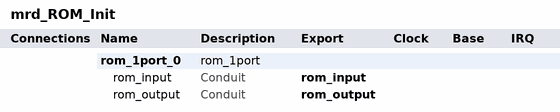
[diagram p0: system contents]
# Platform Designer (Qsys) system mrd_ROM_Init, Arria 10 10AX115U3F45E2SGE3
# Parameters at their usual value, and those the tool derives, are not listed.
package require qsys
create_system mrd_ROM_Init
set_project_property DEVICE_FAMILY {Arria 10}
set_project_property DEVICE 10AX115U3F45E2SGE3

add_instance rom_1port_0 rom_1port 15.1
set_instance_property rom_1port_0 AUTO_EXPORT true
set_instance_parameter_value rom_1port_0 GUI_ADDRESSSTALL_A false
set_instance_parameter_value rom_1port_0 GUI_AclrAddr false
set_instance_parameter_value rom_1port_0 GUI_AclrOutput false
set_instance_parameter_value rom_1port_0 GUI_BlankMemory 1
set_instance_parameter_value rom_1port_0 GUI_CLOCK_ENABLE_INPUT_A false
set_instance_parameter_value rom_1port_0 GUI_CLOCK_ENABLE_OUTPUT_A false
set_instance_parameter_value rom_1port_0 GUI_FILE_REFERENCE 0
set_instance_parameter_value rom_1port_0 GUI_INIT_FILE_LAYOUT PORT_A
set_instance_parameter_value rom_1port_0 GUI_INIT_TO_SIM_X false
set_instance_parameter_value rom_1port_0 GUI_JTAG_ENABLED false
set_instance_parameter_value rom_1port_0 GUI_JTAG_ID NONE
set_instance_parameter_value rom_1port_0 GUI_MAXIMUM_DEPTH 0
set_instance_parameter_value rom_1port_0 GUI_MIFfilename C:/work/pj104/code/1702/Mixed_Radix_DFT/IP/mif_InitROM.mif
set_instance_parameter_value rom_1port_0 GUI_NUMWORDS_A 72
set_instance_parameter_value rom_1port_0 GUI_RAM_BLOCK_TYPE Auto
set_instance_parameter_value rom_1port_0 GUI_RegAddr true
set_instance_parameter_value rom_1port_0 GUI_RegOutput true
set_instance_parameter_value rom_1port_0 GUI_SclrOutput false
set_instance_parameter_value rom_1port_0 GUI_SingleClock 0
set_instance_parameter_value rom_1port_0 GUI_WIDTH_A 64
set_instance_parameter_value rom_1port_0 GUI_rden false

# exported interfaces
add_interface rom_input conduit end
set_interface_property rom_input EXPORT_OF rom_1port_0.rom_input
add_interface rom_output conduit end
set_interface_property rom_output EXPORT_OF rom_1port_0.rom_output

set_interconnect_requirement {$system} qsys_mm.clockCrossingAdapter HANDSHAKE
set_interconnect_requirement {$system} qsys_mm.enableEccProtection FALSE
set_interconnect_requirement {$system} qsys_mm.insertDefaultSlave FALSE
set_interconnect_requirement {$system} qsys_mm.maxAdditionalLatency 1

save_system mrd_ROM_Init.qsys
